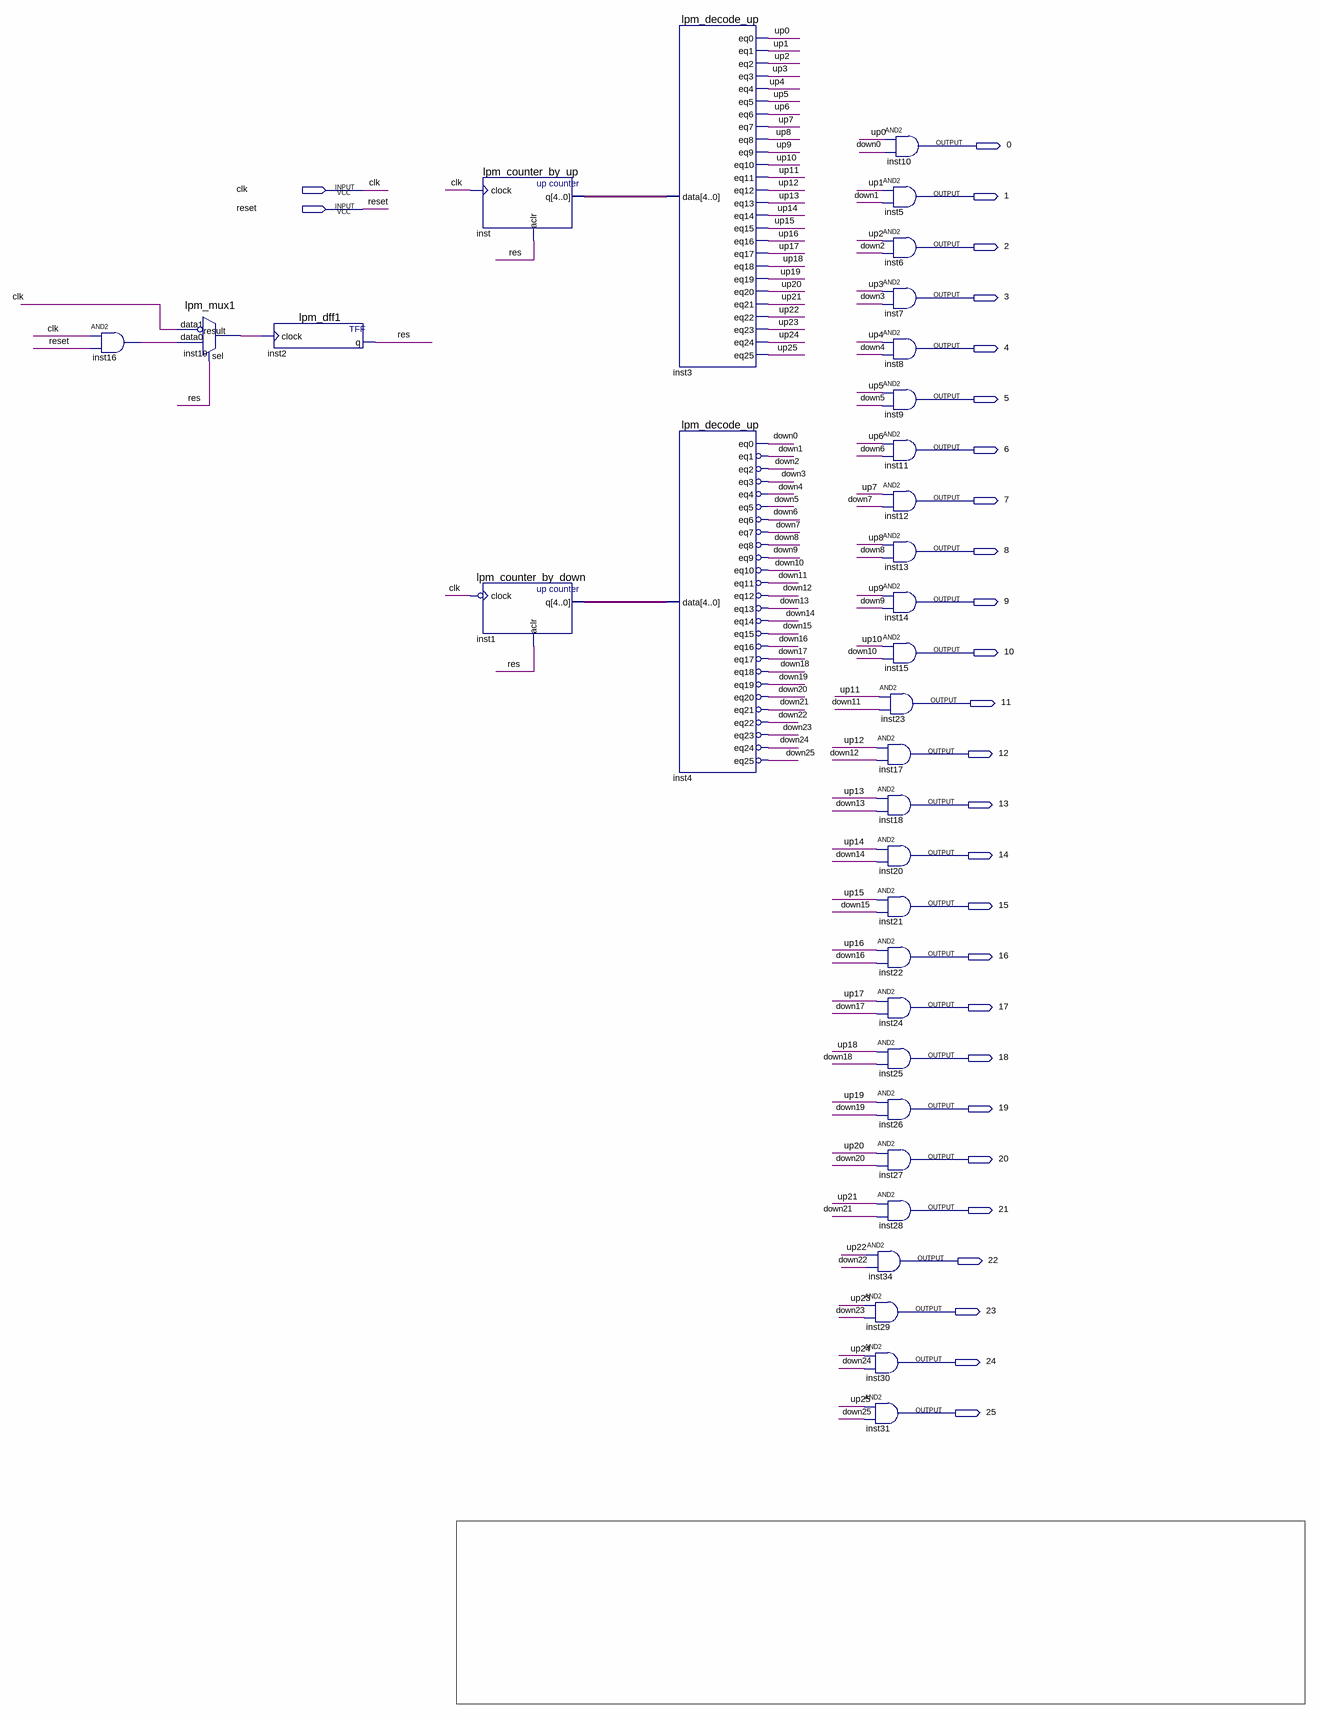
[diagram p0: schematic sheet]
// Quartus schematic DCa.bdf as structural Verilog: 33 symbols, 28 pins
module DCa (
  input  clk,
  input  reset,
  output \0 ,
  output \1 ,
  output \2 ,
  output \3 ,
  output \4 ,
  output \5 ,
  output \6 ,
  output \7 ,
  output \8 ,
  output \9 ,
  output \10 ,
  output \11 ,
  output \12 ,
  output \13 ,
  output \14 ,
  output \15 ,
  output \16 ,
  output \17 ,
  output \18 ,
  output \19 ,
  output \20 ,
  output \21 ,
  output \22 ,
  output \23 ,
  output \24 ,
  output \25 
);

  wire down0, down1, down2, down3, down4, down5, down6, down7, down8, down9, down10, down11, down12, down13,
       down14, down15, down16, down17, down18, down19, down20, down21, down22, down23, down24, down25,
       inst4_eq1, inst4_eq2, inst4_eq3, inst4_eq4, inst4_eq5, inst4_eq6, inst4_eq7, inst4_eq8, inst4_eq9,
       inst4_eq10, inst4_eq11, inst4_eq12, inst4_eq13, inst4_eq14, inst4_eq15, inst4_eq16, inst4_eq17,
       inst4_eq18, inst4_eq19, inst4_eq20, inst4_eq21, inst4_eq22, inst4_eq23, inst4_eq24, inst4_eq25,
       inst16_out, inst19_result, res, up0, up1, up2, up3, up4, up5, up6, up7, up8, up9, up10, up11, up12,
       up13, up14, up15, up16, up17, up18, up19, up20, up21, up22, up23, up24, up25;
  wire [4:0] inst1_q, inst_q;

  and inst16 (inst16_out, clk, reset);
  lpm_mux1 inst19 (.data1(~clk), .data0(inst16_out), .sel(res), .result(inst19_result));
  lpm_dff1 inst2 (.clock(inst19_result), .q(res));
  lpm_counter_by_up inst (.clock(clk), .aclr(res), .q(inst_q));
  lpm_counter_by_down inst1 (.clock(~clk), .aclr(res), .q(inst1_q));
  lpm_decode_up inst3 (
    .data(inst_q), .eq0(up0), .eq1(up1), .eq2(up2), .eq3(up3), .eq4(up4), .eq5(up5), .eq6(up6), .eq7(up7),
    .eq8(up8), .eq9(up9), .eq10(up10), .eq11(up11), .eq12(up12), .eq13(up13), .eq14(up14), .eq15(up15),
    .eq16(up16), .eq17(up17), .eq18(up18), .eq19(up19), .eq20(up20), .eq21(up21), .eq22(up22), .eq23(up23),
    .eq24(up24), .eq25(up25));
  lpm_decode_up inst4 (
    .data(inst1_q), .eq0(down0), .eq1(inst4_eq1), .eq2(inst4_eq2), .eq3(inst4_eq3), .eq4(inst4_eq4),
    .eq5(inst4_eq5), .eq6(inst4_eq6), .eq7(inst4_eq7), .eq8(inst4_eq8), .eq9(inst4_eq9), .eq10(inst4_eq10),
    .eq11(inst4_eq11), .eq12(inst4_eq12), .eq13(inst4_eq13), .eq14(inst4_eq14), .eq15(inst4_eq15),
    .eq16(inst4_eq16), .eq17(inst4_eq17), .eq18(inst4_eq18), .eq19(inst4_eq19), .eq20(inst4_eq20),
    .eq21(inst4_eq21), .eq22(inst4_eq22), .eq23(inst4_eq23), .eq24(inst4_eq24), .eq25(inst4_eq25));
  not inst4_eq1_inverted (down1, inst4_eq1);
  not inst4_eq2_inverted (down2, inst4_eq2);
  not inst4_eq3_inverted (down3, inst4_eq3);
  not inst4_eq4_inverted (down4, inst4_eq4);
  not inst4_eq5_inverted (down5, inst4_eq5);
  not inst4_eq6_inverted (down6, inst4_eq6);
  not inst4_eq7_inverted (down7, inst4_eq7);
  not inst4_eq8_inverted (down8, inst4_eq8);
  not inst4_eq9_inverted (down9, inst4_eq9);
  not inst4_eq10_inverted (down10, inst4_eq10);
  not inst4_eq11_inverted (down11, inst4_eq11);
  not inst4_eq12_inverted (down12, inst4_eq12);
  not inst4_eq13_inverted (down13, inst4_eq13);
  not inst4_eq14_inverted (down14, inst4_eq14);
  not inst4_eq15_inverted (down15, inst4_eq15);
  not inst4_eq16_inverted (down16, inst4_eq16);
  not inst4_eq17_inverted (down17, inst4_eq17);
  not inst4_eq18_inverted (down18, inst4_eq18);
  not inst4_eq19_inverted (down19, inst4_eq19);
  not inst4_eq20_inverted (down20, inst4_eq20);
  not inst4_eq21_inverted (down21, inst4_eq21);
  not inst4_eq22_inverted (down22, inst4_eq22);
  not inst4_eq23_inverted (down23, inst4_eq23);
  not inst4_eq24_inverted (down24, inst4_eq24);
  not inst4_eq25_inverted (down25, inst4_eq25);
  and inst23 (\11 , up11, down11);
  and inst17 (\12 , up12, down12);
  and inst18 (\13 , up13, down13);
  and inst20 (\14 , up14, down14);
  and inst21 (\15 , up15, down15);
  and inst22 (\16 , up16, down16);
  and inst24 (\17 , up17, down17);
  and inst25 (\18 , up18, down18);
  and inst26 (\19 , up19, down19);
  and inst27 (\20 , up20, down20);
  and inst28 (\21 , up21, down21);
  and inst34 (\22 , up22, down22);
  and inst29 (\23 , up23, down23);
  and inst30 (\24 , up24, down24);
  and inst31 (\25 , up25, down25);
  and inst10 (\0 , up0, down0);
  and inst5 (\1 , up1, down1);
  and inst6 (\2 , up2, down2);
  and inst7 (\3 , up3, down3);
  and inst8 (\4 , up4, down4);
  and inst9 (\5 , up5, down5);
  and inst11 (\6 , up6, down6);
  and inst12 (\7 , up7, down7);
  and inst13 (\8 , up8, down8);
  and inst14 (\9 , up9, down9);
  and inst15 (\10 , up10, down10);
endmodule
